# Altium project IoTProject_V1.1.PrjPcb (part 2 of 2)

## Sheet [08] - MCU.SchDoc
size A3; DocumentNumber: 8; SheetNumber: 8; SheetTotal: 9
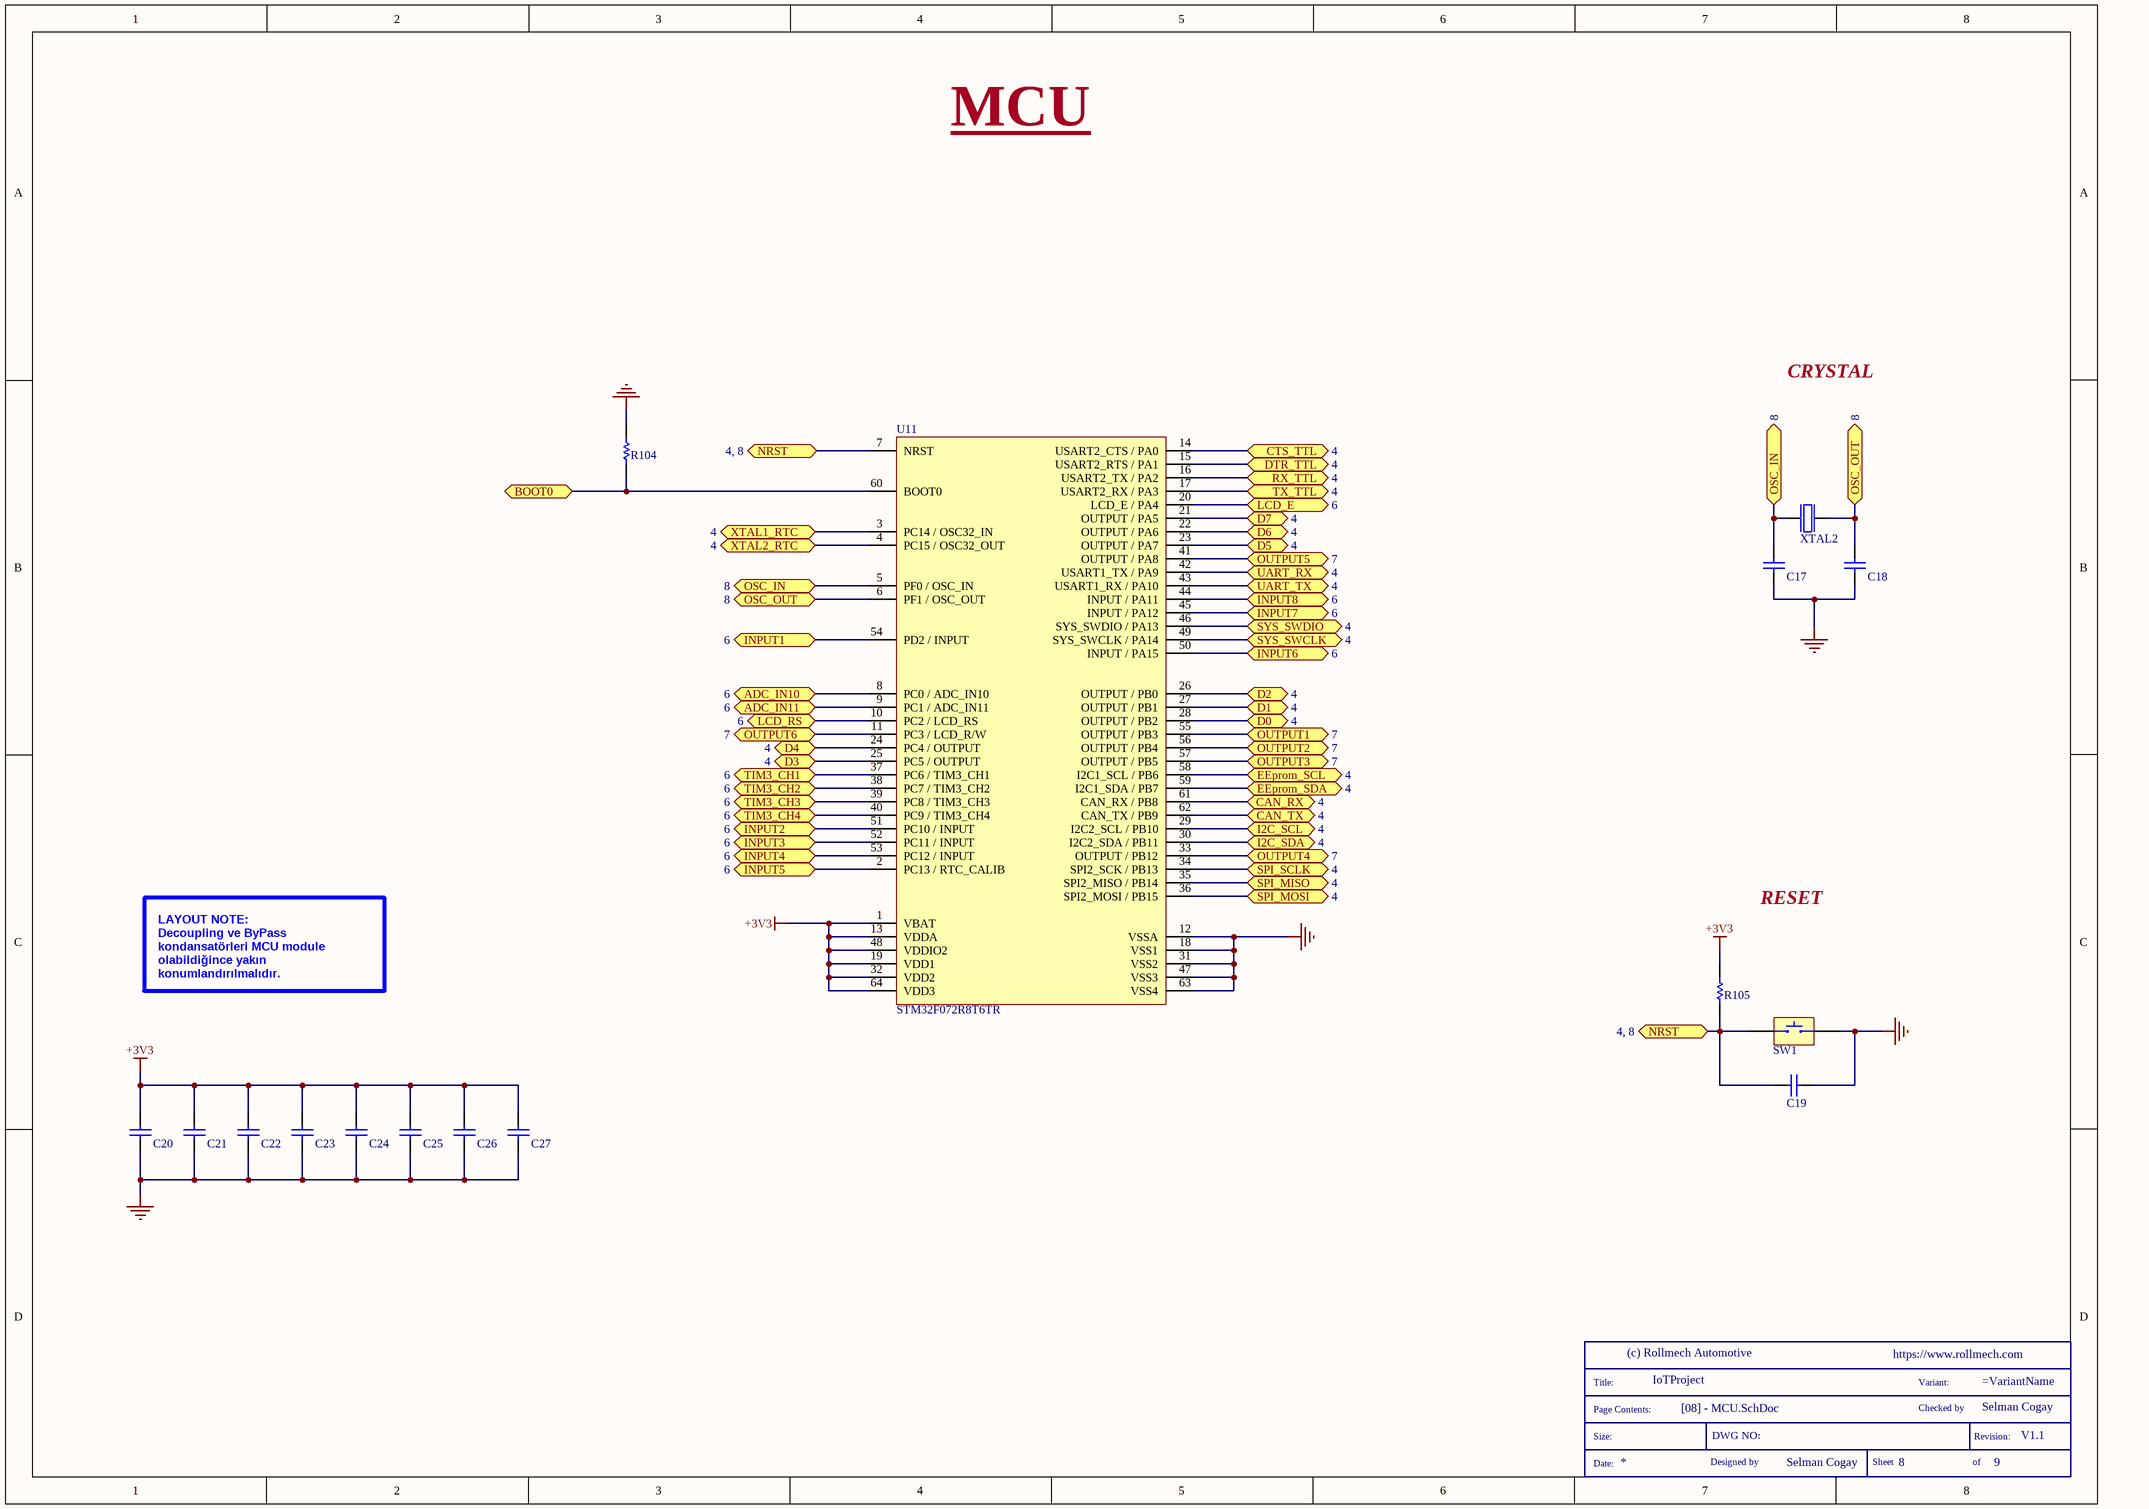
[diagram p5: [08] - MCU.SchDoc]

### Parts
(Parts that share a designator on the sheet are numbered #1, #2 ... from top to bottom, then left to right.)
*#6  SCH_TITLE  (value not drawn)  (graphical)
C17  22pF 100V  [CAP_CER_0603]  (value not drawn)
C18  22pF 100V  [CAP_CER_0603]  (value not drawn)
C19  100nF 35V  [CAP_CER_0603]  (value not drawn)
C20  100nF 35V  [CAP_CER_0603]  (value not drawn)
C21  100nF 35V  [CAP_CER_0603]  (value not drawn)
C22  100nF 35V  [CAP_CER_0603]  (value not drawn)
C23  100nF 35V  [CAP_CER_0603]  (value not drawn)
C24  1uF 35V  [C0603]  (value not drawn)
C25  10nF 100V  [CAP_CER_0805]  (value not drawn)
C26  4.7uF 35V  [CAP_CER_0805]  (value not drawn)
C27  4.7uF 35V  [CAP_CER_0805]  (value not drawn)
R104  5.6k 1/8W  [RES_0805]  (value not drawn)
R105  5.6k 1/8W  [RES_0805]  (value not drawn)
SW1  TAC SW  [TAC-SW]  (value not drawn)
U11  STM32F072R8T6TR  [LQFP64]
XTAL2  8.000MHZ  [XTAL_4SMD]  (value not drawn)

### Ports
ADC_IN10 (see 6), ADC_IN11 (see 6), BOOT0, CAN_RX (see 4), CAN_TX (see 4), CTS_TTL (see 4), D0 (see 4), D1 (see 4), D2 (see 4), D3 (see 4), D4 (see 4), D5 (see 4), D6 (see 4), D7 (see 4), DTR_TTL (see 4), EEprom_SCL (see 4), EEprom_SDA (see 4), I2C_SCL (see 4), I2C_SDA (see 4), INPUT1 (see 6), INPUT2 (see 6), INPUT3 (see 6), INPUT4 (see 6), INPUT5 (see 6), INPUT6 (see 6), INPUT7 (see 6), INPUT8 (see 6), LCD_E (see 6), LCD_RS (see 6), NRST (see 4, 8), OSC_IN (see 8), OSC_OUT (see 8), OUTPUT1 (see 7), OUTPUT2 (see 7), OUTPUT3 (see 7), OUTPUT4 (see 7), OUTPUT5 (see 7), OUTPUT6 (see 7), RX_TTL (see 4), SPI_MISO (see 4), SPI_MOSI (see 4), SPI_SCLK (see 4), SYS_SWCLK (see 4), SYS_SWDIO (see 4), TIM3_CH1 (see 6), TIM3_CH2 (see 6), TIM3_CH3 (see 6), TIM3_CH4 (see 6), TX_TTL (see 4), UART_RX (see 4), UART_TX (see 4), XTAL1_RTC (see 4), XTAL2_RTC (see 4)

### Nets
+3V3: C20.2 C21.2 C22.2 C23.2 C24.2 C25.2 C26.2 C27.2 R105.2 U11.1(VBAT) U11.13(VDDA) U11.19(VDD1) U11.32(VDD2) U11.48(VDDIO2) U11.64(VDD3)
GND: C17.1 C18.1 C19.2 C20.1 C21.1 C22.1 C23.1 C24.1 C25.1 C26.1 C27.1 R104.2 SW1.2 U11.12(VSSA) U11.18(VSS1) U11.31(VSS2) U11.47(VSS3) U11.63(VSS4)
NetC17_2: C17.2 U11.5(PF0_/_OSC_IN) XTAL2.3 ; port OSC_IN
NetC18_2: C18.2 U11.6(PF1_/_OSC_OUT) XTAL2.1 ; port OSC_OUT
NetC19_1: C19.1 R105.1 SW1.1 U11.7(NRST) ; port NRST
NetJ4_2: U11.42(USART1_TX_/_PA9) ; port UART_RX
NetJ4_3: U11.43(USART1_RX_/_PA10) ; port UART_TX
NetJ5_2: U11.14(USART2_CTS_/_PA0) ; port CTS_TTL
NetJ5_3: U11.15(USART2_RTS_/_PA1) ; port DTR_TTL
NetJ5_4: U11.16(USART2_TX_/_PA2) ; port RX_TTL
NetJ5_5: U11.17(USART2_RX_/_PA3) ; port TX_TTL
NetJ7_2: U11.29(I2C2_SCL_/_PB10) ; port I2C_SCL
NetJ7_3: U11.30(I2C2_SDA_/_PB11) ; port I2C_SDA
NetJ8_3: U11.36(SPI2_MOSI_/_PB15) ; port SPI_MOSI
NetJ8_4: U11.35(SPI2_MISO_/_PB14) ; port SPI_MISO
NetJ8_5: U11.34(SPI2_SCK_/_PB13) ; port SPI_SCLK
NetJ9_4: U11.10(PC2_/_LCD_RS) ; port LCD_RS
NetJ9_6: U11.20(LCD_E_/_PA4) ; port LCD_E
NetJ9_7: U11.28(OUTPUT_/_PB2) ; port D0
NetJ9_8: U11.27(OUTPUT_/_PB1) ; port D1
NetJ9_9: U11.26(OUTPUT_/_PB0) ; port D2
NetJ9_10: U11.25(PC5_/_OUTPUT) ; port D3
NetJ9_11: U11.24(PC4_/_OUTPUT) ; port D4
NetJ9_12: U11.23(OUTPUT_/_PA7) ; port D5
NetJ9_13: U11.22(OUTPUT_/_PA6) ; port D6
NetJ9_14: U11.21(OUTPUT_/_PA5) ; port D7
NetJ18_2: U11.8(PC0_/_ADC_IN10) ; port ADC_IN10
NetJ19_2: U11.9(PC1_/_ADC_IN11) ; port ADC_IN11
NetJ20_1: U11.40(PC9_/_TIM3_CH4) ; port TIM3_CH4
NetJ20_2: U11.39(PC8_/_TIM3_CH3) ; port TIM3_CH3
NetJ20_3: U11.38(PC7_/_TIM3_CH2) ; port TIM3_CH2
NetJ20_4: U11.37(PC6_/_TIM3_CH1) ; port TIM3_CH1
NetR5_1: U11.62(CAN_TX_/_PB9) ; port CAN_TX
NetR8_1: U11.61(CAN_RX_/_PB8) ; port CAN_RX
NetR12_1: U11.49(SYS_SWCLK_/_PA14) ; port SYS_SWCLK
NetR13_1: U11.46(SYS_SWDIO_/_PA13) ; port SYS_SWDIO
NetR17_2: U11.59(I2C1_SDA_/_PB7) ; port EEprom_SDA
NetR18_2: U11.58(I2C1_SCL_/_PB6) ; port EEprom_SCL
NetR20_2: U11.3(PC14_/_OSC32_IN) ; port XTAL1_RTC
NetR21_2: U11.4(PC15_/_OSC32_OUT) ; port XTAL2_RTC
NetR24_1: U11.54(PD2_/_INPUT) ; port INPUT1
NetR25_1: U11.51(PC10_/_INPUT) ; port INPUT2
NetR36_1: U11.52(PC11_/_INPUT) ; port INPUT3
NetR37_1: U11.53(PC12_/_INPUT) ; port INPUT4
NetR48_1: U11.2(PC13_/_RTC_CALIB) ; port INPUT5
NetR49_1: U11.50(INPUT_/_PA15) ; port INPUT6
NetR60_1: U11.45(INPUT_/_PA12) ; port INPUT7
NetR61_1: U11.44(INPUT_/_PA11) ; port INPUT8
NetR74_1: U11.55(OUTPUT_/_PB3) ; port OUTPUT1
NetR75_1: U11.33(OUTPUT_/_PB12) ; port OUTPUT4
NetR84_1: U11.56(OUTPUT_/_PB4) ; port OUTPUT2
NetR85_1: U11.41(OUTPUT_/_PA8) ; port OUTPUT5
NetR94_1: U11.57(OUTPUT_/_PB5) ; port OUTPUT3
NetR95_1: U11.11(PC3_/_LCD_R/W) ; port OUTPUT6
NetR104_1: R104.1 U11.60(BOOT0) ; port BOOT0

### Notes on the sheet
- MCU
- CRYSTAL
- RESET
- LAYOUT NOTE:
  Decoupling ve ByPass kondansatörleri MCU module olabildiğince yakın konumlandırılmalıdır.
- (in symbol SCH_TITLE) Title:; Variant:; Page Contents:; Checked by; Size:; DWG NO:; Revision:; Date:; Designed by; Sheet; of

### Library data of the parts
*#6 = SCH_TITLE: Schematic information
C17 C18 = GCM1885C2A220FA16D: CAP CER 22PF 100V C0G/NP0 0603; Manufacturer 1: Murata Electronics North America; Category: Ceramic Capacitors; Manufacturer Part Number 1: GCM1885C2A220FA16D; Case/Package: 0603 (1608 Metric); Quantity: 1; Supplier 1: Digikey; Supplier Part Number 1: 490-16413-1-ND; Supplier Order Qty 1: 1; Supplier Stock 1: 22604; Supplier Unit Price 1: 0,22; Supplier Currency 1: $
C19-C23 = GMK107BJ104KAHT: CAP CER 100nf 35V X5R 0603; Manufacturer 1: Taiyo Yuden; Category: Ceramic Capacitors; Manufacturer Part Number 1: GMK107BJ104KAHT; Case/Package: 0603 (1608 Metric); Quantity: 1; Supplier 1: Digikey; Supplier Part Number 1: 587-3357-1-ND; Supplier Order Qty 1: 1; Supplier Stock 1: 97932; Supplier Unit Price 1: 0,14; Supplier Currency 1: $
C24 = CGA3E3X5R1V105K080AB: CAP CER 1UF 35V; Manufacturer 1: TDK Corporation; Category: Ceramic Capacitors; Manufacture Part Number 1: CGA3E3X5R1V105K080AB; Case/Package: 0603 (1608 Metric); Quantity: 1; Supplier 1: Digikey; Supplier Part Number 1: 445-12484-1-ND; Supplier Order Qty 1: 1; Supplier Stock 1: 11910; Supplier Unit Price 1: 0,25; Supplier Currency 1: $
C25 = CL21B103KC6WPNC: CAP CER 10nF 100V; Manufacturer 1: Samsung Electro-Mechanics; Category: Ceramic Capacitors; Manufacturer Part Number 1: CL21B103KC6WPNC; Case/Package: 0805 (2012 Metric); Quantity: 1; Supplier 1: Digikey; Supplier Part Number 1: 1276-6845-1-ND; Supplier Order Qty 1: 1; Supplier Stock 1: 38701; Supplier Unit Price 1: 0,1; Supplier Currency 1: $
C26 C27 = GRT21BC8YA475KE13L: CAP CER 100nf 35V X5R 0603; Manufacturer 1: Murata Electronics North America; Category: Ceramic Capacitors; Manufacturer Part Number 1: GRT21BC8YA475KE13L; Case/Package: 0805 (2012 Metric); Quantity: 1; Supplier 1: Digikey; Supplier Part Number 1: 490-12361-1-ND; Supplier Order Qty 1: 1; Supplier Stock 1: 5076; Supplier Unit Price 1: 0,45; Supplier Currency 1: $
R104 R105 = ERJ-6ENF5601V: RES SMD 5.6K OHM 1% 1/8W 0805; Manufacturer 1: Panasonic Electronic Components; Category: Chip Resistor - Surface Mount; Manufacturer Part Number 1: ERJ-6ENF5601V; Case/Package: 0805 (2012 Metric); Quantity: 1; Supplier 1: Digikey; Supplier Part Number 1: P5.60KCCT-ND; Supplier Order Qty 1: 1; Supplier Stock 1: 71341; Supplier Unit Price 1: 0,1; Supplier Currency 1: $
SW1 = FSMSMTR: SWITCH TACTILE SPST-NO 0.05A 24V; Manufacturer 1: TE Connectivity ALCOSWITCH Switches; Category: Tactile Switches; Manufacturer Part Number 1: FSMSMTR; Case/Package: *; Quantity: 1; Supplier 1: Digikey; Supplier Part Number 1: 450-1758-1-ND; Supplier Order Qty 1: 1; Supplier Stock 1: 28743; Supplier Unit Price 1: 0,47; Supplier Currency 1: $
U11 = STM32F072R8T6TR: IC MCU 32BIT 64KB FLASH 64LQFP; Manufacturer 1: STMicroelectronics; Category: Embedded - Microcontrollers; Manufacture Part Number 1: STM32F072R8T6TR; Case/Package: 64-LQFP; Quantity: 1; Supplier 1: Digikey; Supplier Part Number 1: 497-17362-1-ND; Supplier Order Qty 1: 1; Supplier Stock 1: 441; Supplier Unit Price 1: 3,84; Supplier Currency 1: $
XTAL2 = ECS-80-18-20BQ-DS: CRYSTAL 8.000MHZ; Manufacturer 1: ECS Inc.; Category: Crystals; Manufacturer Part Number 1: ECS-80-18-20BQ-DS; Case/Package: 4-SMD, No Lead; Quantity: 1; Supplier 1: Digikey; Supplier Part Number 1: XC2015CT-ND; Supplier Order Qty 1: 1; Supplier Stock 1: 15309; Supplier Unit Price 1: 1,26; Supplier Currency 1: $

## Nets that join several sheets
+3V3: [03] - POWER (C3.2 R2.1 U1.2), [04] - COMMUNICATION (10 pins), [06] - INPUT (8 pins), [08] - MCU (15 pins)
+5V: [03] - POWER (C5.2 R3.1 U2.2), [04] - COMMUNICATION (J2.3 R10.1), [05] - EEPROM-RTC-LCD (6 pins), [06] - INPUT (14 pins), [07] - OUTPUT (8 pins)
+12V/5V: [06] - INPUT (11 pins), [07] - OUTPUT (15 pins)
GND: [03] - POWER (13 pins), [04] - COMMUNICATION (15 pins), [05] - EEPROM-RTC-LCD (10 pins), [06] - INPUT (44 pins), [07] - OUTPUT (30 pins), [08] - MCU (18 pins)
Vın: [03] - POWER (6 pins), [06] - INPUT (J21.1 R70.2), [07] - OUTPUT (J28.1 R103.2)
NetC19_1: [04] - COMMUNICATION (R15.1), [08] - MCU (C19.1 R105.1 SW1.1 U11.7)
NetJ4_2: [04] - COMMUNICATION (J4.2), [08] - MCU (U11.42)
NetJ4_3: [04] - COMMUNICATION (J4.3), [08] - MCU (U11.43)
NetJ5_2: [04] - COMMUNICATION (J5.2), [08] - MCU (U11.14)
NetJ5_3: [04] - COMMUNICATION (J5.3), [08] - MCU (U11.15)
NetJ5_4: [04] - COMMUNICATION (J5.4), [08] - MCU (U11.16)
NetJ5_5: [04] - COMMUNICATION (J5.5), [08] - MCU (U11.17)
NetJ7_2: [04] - COMMUNICATION (J7.2 R14.1), [08] - MCU (U11.29)
NetJ7_3: [04] - COMMUNICATION (J7.3 R11.1), [08] - MCU (U11.30)
NetJ8_3: [04] - COMMUNICATION (J8.3), [08] - MCU (U11.36)
NetJ8_4: [04] - COMMUNICATION (J8.4), [08] - MCU (U11.35)
NetJ8_5: [04] - COMMUNICATION (J8.5), [08] - MCU (U11.34)
NetJ9_4: [05] - EEPROM-RTC-LCD (J9.4), [08] - MCU (U11.10)
NetJ9_6: [05] - EEPROM-RTC-LCD (J9.6), [08] - MCU (U11.20)
NetJ9_7: [05] - EEPROM-RTC-LCD (J9.7), [08] - MCU (U11.28)
NetJ9_8: [05] - EEPROM-RTC-LCD (J9.8), [08] - MCU (U11.27)
NetJ9_9: [05] - EEPROM-RTC-LCD (J9.9), [08] - MCU (U11.26)
NetJ9_10: [05] - EEPROM-RTC-LCD (J9.10), [08] - MCU (U11.25)
NetJ9_11: [05] - EEPROM-RTC-LCD (J9.11), [08] - MCU (U11.24)
NetJ9_12: [05] - EEPROM-RTC-LCD (J9.12), [08] - MCU (U11.23)
NetJ9_13: [05] - EEPROM-RTC-LCD (J9.13), [08] - MCU (U11.22)
NetJ9_14: [05] - EEPROM-RTC-LCD (J9.14), [08] - MCU (U11.21)
NetJ18_2: [06] - INPUT (J18.2), [08] - MCU (U11.8)
NetJ19_2: [06] - INPUT (J19.2), [08] - MCU (U11.9)
NetJ20_1: [06] - INPUT (J20.1), [08] - MCU (U11.40)
NetJ20_2: [06] - INPUT (J20.2), [08] - MCU (U11.39)
NetJ20_3: [06] - INPUT (J20.3), [08] - MCU (U11.38)
NetJ20_4: [06] - INPUT (J20.4), [08] - MCU (U11.37)
NetR5_1: [04] - COMMUNICATION (R5.1), [08] - MCU (U11.62)
NetR8_1: [04] - COMMUNICATION (R8.1), [08] - MCU (U11.61)
NetR12_1: [04] - COMMUNICATION (R12.1), [08] - MCU (U11.49)
NetR13_1: [04] - COMMUNICATION (R13.1), [08] - MCU (U11.46)
NetR17_2: [05] - EEPROM-RTC-LCD (R17.2 U4.5), [08] - MCU (U11.59)
NetR18_2: [05] - EEPROM-RTC-LCD (R18.2 U4.6), [08] - MCU (U11.58)
NetR20_2: [05] - EEPROM-RTC-LCD (R20.2), [08] - MCU (U11.3)
NetR21_2: [05] - EEPROM-RTC-LCD (R21.2), [08] - MCU (U11.4)
NetR24_1: [06] - INPUT (R24.1 R28.1 U12.6), [08] - MCU (U11.54)
NetR25_1: [06] - INPUT (R25.1 R29.1 U13.6), [08] - MCU (U11.51)
NetR36_1: [06] - INPUT (R36.1 R40.1 U14.6), [08] - MCU (U11.52)
NetR37_1: [06] - INPUT (R37.1 R41.1 U15.6), [08] - MCU (U11.53)
NetR48_1: [06] - INPUT (R48.1 R52.1 U16.6), [08] - MCU (U11.2)
NetR49_1: [06] - INPUT (R49.1 R53.1 U17.6), [08] - MCU (U11.50)
NetR60_1: [06] - INPUT (R60.1 R64.1 U18.6), [08] - MCU (U11.45)
NetR61_1: [06] - INPUT (R61.1 R65.1 U19.6), [08] - MCU (U11.44)
NetR74_1: [07] - OUTPUT (R74.1 R76.2), [08] - MCU (U11.55)
NetR75_1: [07] - OUTPUT (R75.1 R77.2), [08] - MCU (U11.33)
NetR84_1: [07] - OUTPUT (R84.1 R86.2), [08] - MCU (U11.56)
NetR85_1: [07] - OUTPUT (R85.1 R87.2), [08] - MCU (U11.41)
NetR94_1: [07] - OUTPUT (R94.1 R96.2), [08] - MCU (U11.57)
NetR95_1: [07] - OUTPUT (R95.1 R97.2), [08] - MCU (U11.11)

## Assembly variants
COMM 3V3 - I/O 5V: not fitted R10 R26 R27 R38 R39 R50 R51 R62 R63 R70 R103
COMM 5V - I/O 12V: not fitted R9 R30 R31 R42 R43 R54 R55 R66 R67 R71 R102